# Altium schematic sheet Motor Driver.SchDoc: Solar Tracker - Motor Driver
size A4; SheetNumber: 3; SheetTotal: 3
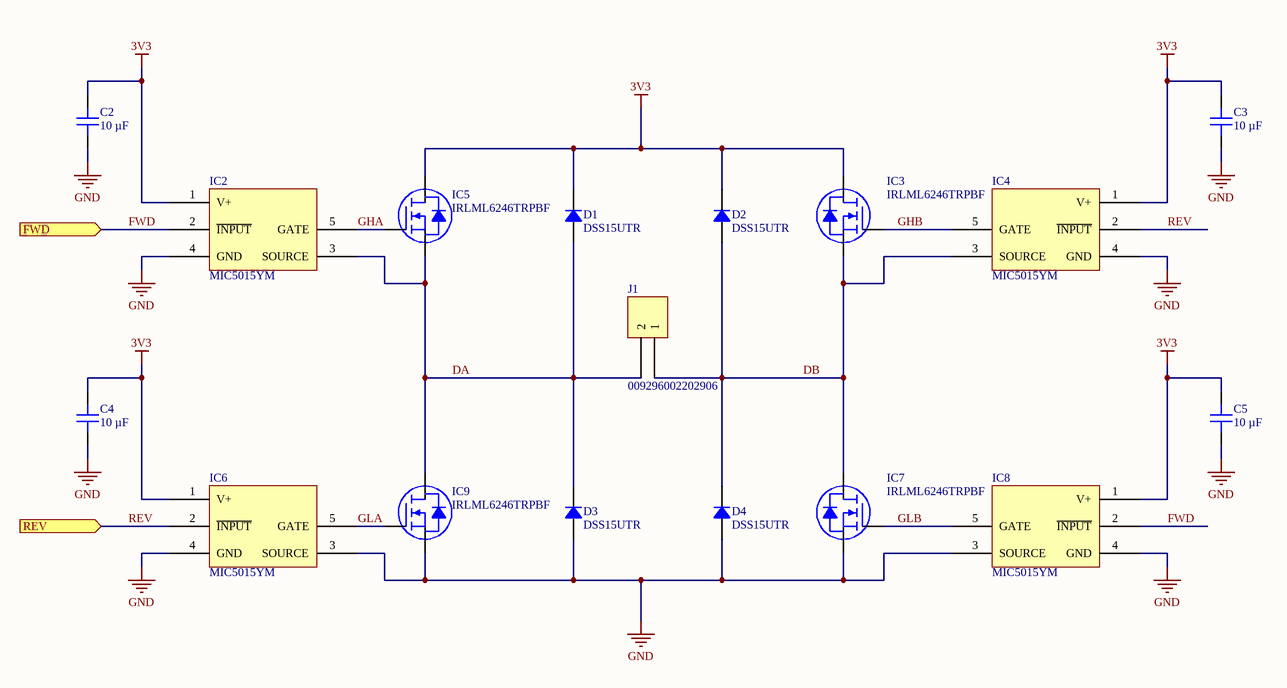
[diagram p0: Motor Driver.SchDoc]

## Parts
C2  10 µF  [CAP 1210_3225 - 1MM]
C3  10 µF  [CAP 1210_3225 - 1MM]
C4  10 µF  [CAP 1210_3225 - 1MM]
C5  10 µF  [CAP 1210_3225 - 1MM]
D1  DSS15UTR  [SOD123F]
D2  DSS15UTR  [SOD123F]
D3  DSS15UTR  [SOD123F]
D4  DSS15UTR  [SOD123F]
IC2  MIC5015YM  [MICROCHIP MICREL SOP-8 M]
IC3  IRLML6246TRPBF  [INFINEON SOT-23-3]
IC4  MIC5015YM  [MICROCHIP MICREL SOP-8 M]
IC5  IRLML6246TRPBF  [INFINEON SOT-23-3]
IC6  MIC5015YM  [MICROCHIP MICREL SOP-8 M]
IC7  IRLML6246TRPBF  [INFINEON SOT-23-3]
IC8  MIC5015YM  [MICROCHIP MICREL SOP-8 M]
IC9  IRLML6246TRPBF  [INFINEON SOT-23-3]
J1  009296002202906  [AVX 9296002202806]

## Ports
FWD (in), REV (in)

## Nets
3V3: C2.2 C3.2 C4.2 C5.2 D1.2 D2.2 IC2.1(V+) IC3.3(D) IC4.1(V+) IC5.3(D) IC6.1(V+) IC8.1(V+)
GND: C2.1 C3.1 C4.1 C5.1 D3.1 D4.1 IC2.4(GND) IC4.4(GND) IC6.3(SOURCE) IC6.4(GND) IC7.2(S) IC8.3(SOURCE) IC8.4(GND) IC9.2(S)
DA: D1.1 D3.2 IC2.3(SOURCE) IC5.2(S) IC9.3(D) J1.2
DB: D2.1 D4.2 IC3.2(S) IC4.3(SOURCE) IC7.3(D) J1.1
FWD: IC2.2(~{INPUT}) IC8.2(~{INPUT}) ; port FWD
GHA: IC2.5(GATE) IC5.1(G)
GHB: IC3.1(G) IC4.5(GATE)
GLA: IC6.5(GATE) IC9.1(G)
GLB: IC7.1(G) IC8.5(GATE)
REV: IC4.2(~{INPUT}) IC6.2(~{INPUT}) ; port REV

## Notes on the sheet
- Title
- Size:
- Date:
- A4
- Number:
- Time:
- Revision:
- Sheet
- of
- File:

## Library data of the parts
C2-C5 = CL32A106MOJNNNE: CAP CER 10UF 16V X5R 1210; manufacturer: Samsung Electro-Mechanics; Tolerance: ±20%; Part Number: CL32A106MOJNNNE; Value: 10 µF; Applications: General Purpose; Capacitance: 10 µF; componentlink1description: Datasheet; componentlink1url: http://www.samsungsem.com/kr/support/product-search/mlcc/CL32A106MOJNNNE.jsp; componentlink2description: DigiKey Link; componentlink2url: https://www.digikey.com/en/products/detail/samsung-electro-mechanics/CL32A106MOJNNNE/3888522; Device Package: 1210 (3225 Metric); lastupdated: 03/03/2022 14:36:33; Lifecycle Status: Active; Minimum Order: 1; Mounting Type: Surface Mount, MLCC; Operating Temperature: -55°C ~ 85°C; Package / Case: 1210 (3225 Metric); packaging: TapeAndReel; partid: 23713; Part Status: Active; price: 0.07; series: CL; Size / Dimension: 0.126" L x 0.098" W (3.20mm x 2.50mm); Supplier 1: DigiKey; Supplier Part Number 1: 1276-2864-1-ND; Temperature Coefficient: X5R; Thickness (Max): 0.106" (2.70mm); Voltage - Rated: 16V
D1-D4 = DSS15UTR: SCHOTTKY 50V SOD-123FL; Manufacturer: SMC Diode Solutions; Capacitance @ Vr, F: 110pF @ 4V, 1MHz; Current - Average Rectified (Io): 1A; Current - Reverse Leakage @ Vr: 100 µA @ 50 V; Speed: Fast Recovery =< 500ns, > 200mA (Io); Voltage - Forward (Vf) (Max) @ If: 670 mV @ 1 A; Part Number: DSS15UTR; ComponentLink1Description: Datasheet; ComponentLink1URL: http://www.smc-diodes.com/propdf/DSS12U%20THRU%20DSS125U%20N1873%20REV.A.pdf; ComponentLink2Description: DigiKey Link; ComponentLink2URL: https://www.digikey.com/en/products/detail/smc-diode-solutions/DSS15UTR/8341860; Diode Type: Schottky; LastUpdated: 03/03/2022 14:49:54; Lifecycle Status: Active; Minimum Order: 1; Mounting Type: Surface Mount; Operating Temperature - Junction: -55°C ~ 150°C; Package / Case: SOD-123F; Packaging: TapeAndReel; PartId: 2511; Part Status: Active; Price: 0.03; Series: -; Supplier 1: DigiKey; Supplier Part Number 1: 1655-1928-1-ND; Supplier Device Package: SOD-123FL; Voltage - DC Reverse (Vr) (Max): 50 V
IC2 IC4 IC6 IC8 = MIC5015YM: IC GATE DRVR HI/LOW SIDE 8SOIC; Manufacturer: Microchip Technology; Channel Type: Single; Driven Configuration: High-Side or Low-Side; Gate Type: N-Channel MOSFET; Input Type: Inverting; Logic Voltage - VIL, VIH: 0.8V, 2V; Number of Drivers: 1; Voltage - Supply: 2.75V ~ 30V; Part Number: MIC5015YM; ComponentLink1Description: Datasheet; ComponentLink1URL: http://ww1.microchip.com/downloads/en/DeviceDoc/mic5014.pdf; ComponentLink2Description: DigiKey Link; ComponentLink2URL: https://www.digikey.com/en/products/detail/microchip-technology/MIC5015YM/771704; LastUpdated: 03/03/2022 15:47:18; Lifecycle Status: Active; Minimum Order: 1; Mounting Type: Surface Mount; Operating Temperature: -40°C ~ 150°C (TJ); Package / Case: 8-SOIC (0.154", 3.90mm Width); Packaging: Tube; PartId: 15; Part Status: Active; Price: 2.00; Series: -; Supplier 1: DigiKey; Supplier Part Number 1: 576-1235-ND; Supplier Device Package: 8-SOIC
IC3 IC5 IC7 IC9 = IRLML6246TRPBF: MOSFET N-CH 20V 4.1A SOT-23; Manufacturer: Infineon Technologies; Current - Continuous Drain (Id) @ 25°C: 4.1A (Ta); Drive Voltage (Max Rds On,  Min Rds On): 2.5V, 4.5V; FET Type: N-Channel; Gate Charge (Qg) (Max) @ Vgs: 3.5nC @ 4.5V; Input Capacitance (Ciss) (Max) @ Vds: 290pF @ 16V; Power Dissipation (Max): 1.3W (Ta); Rds On (Max) @ Id, Vgs: 46mOhm @ 4.1A, 4.5V; Vgs (Max): ±12V; Vgs(th) (Max) @ Id: 1.1V @ 5µA; Part Number: IRLML6246TRPBF; ComponentLink1Description: Datasheet; ComponentLink1URL: https://www.infineon.com/dgdl/irlml6246pbf.pdf?fileId=5546d462533600a40153566878f22621; ComponentLink2Description: DigiKey Link; ComponentLink2URL: http://digikey.com/product-detail/en/infineon-technologies/IRLML6246TRPBF/IRLML6246TRPBFCT-ND/2393880; Drain to Source Voltage (Vdss): 20V; LastUpdated: 02/09/2020 01:25:05; Lifecycle Status: Active; Minimum Order: 1; Mounting Type: Surface Mount; Operating Temperature: -55°C ~ 150°C (TJ); Package / Case: TO-236-3, SC-59, SOT-23-3; Packaging: TapeAndReel; Part Status: Active; Price: 0.09; Series: HEXFET®; Supplier 1: DigiKey; Supplier Part Number 1: IRLML6246TRPBFCT-ND; Supplier Device Package: Micro3™/SOT-23; Technology: MOSFET (Metal Oxide)
J1 = 009296002202906: CONN WIRE POKE-IN 2POS SMD RA; Manufacturer: AVX Corporation; Board-Side Pitch: 0.118" (3.00mm); Connector Type: Individual Wires; Number of Positions: 2; Wire Gauge: 20-26 AWG; Part Number: 009296002202906; Cable Pitch: 0.118" (3.00mm); Cable Termination: Poke-In; Color: White; ComponentLink1Description: Datasheet; ComponentLink1URL: http://datasheets.avx.com/PHLPHorizontal_00-9296.pdf; ComponentLink2Description: DigiKey Link; ComponentLink2URL: http://digikey.com/product-detail/en/avx-corporation/009296002202906/478-9533-1-ND/5161727; Contact Finish: Tin; Features: Closed End; LastUpdated: 01/05/2020 07:29:21; Lifecycle Status: Active; Minimum Order: 1; Mounting Type: Surface Mount, Right Angle; Number of Rows: 1; Packaging: TapeAndReel; Part Status: Active; Price: 0.23; Series: 9296; Supplier 1: DigiKey; Supplier Part Number 1: 478-9533-1-ND